# Altium schematic sheet dispay.SchDoc
size A4
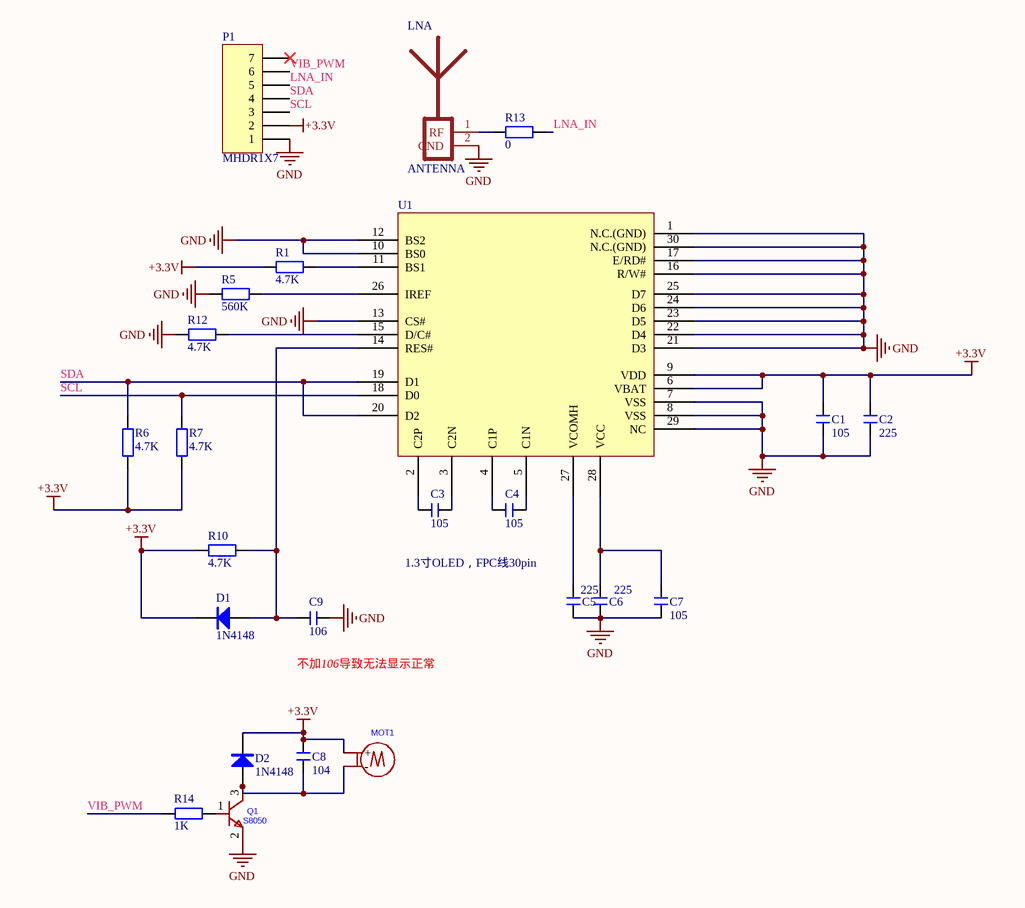
[diagram p0: dispay.SchDoc]

## Parts
C1  105  [C0402-min]
C2  225  [C0402-min]
C3  105  [C0402-min]
C4  105  [C0402-min]
C5  225  [C0402-min]
C6  225  [C0402-min]
C7  105  [C0402-min]
C8  104  [C0402-min]
C9  106  [C0402-min]
D1  1N4148  [SOD-323]
D2  1N4148  [SOD-323]
LNA  ANTENNA  [SWRA117D]
MOT1  LCM1027A2445F  [Vibration_Motor0820]  (value not drawn)
P1  MHDR1X7  [MHDR1X7]
Q1  S8050  [SOT-23-3]
R1  4.7K  [R0402]
R5  560K  [R0402]
R6  4.7K  [R0402]
R7  4.7K  [R0402]
R10  4.7K  [R0402]
R12  4.7K  [R0402]
R13  0  [R0402]
R14  1K  [R0402]
U1  1.3寸OLED，FPC线30pin  [0.96OLED]

## Nets
+3.3V: C1.2 C2.2 C8.2 D1.2(K) D2.2(K) MOT1.2(+) P1.2 R1.1 R6.1 R7.1 R10.1 U1.6(VBAT) U1.9(VDD)
GND: C1.1 C2.1 C5.1 C6.1 C7.1 C9.2 LNA.2(GND) P1.1 Q1.2(E) R5.1 R12.2 U1.1(N.C.(GND)) U1.7(VSS) U1.8(VSS) U1.10(BS0) U1.12(BS2) U1.13(CS#) U1.16(R/W#) U1.17(E/RD#) U1.21(D3) U1.22(D4) U1.23(D5) U1.24(D6) U1.25(D7) U1.29(NC) U1.30(N.C.(GND))
LNA_IN: P1.5 R13.2
SCL: P1.3 R7.2 U1.18(D0)
SDA: P1.4 R6.2 U1.19(D1) U1.20(D2)
VIB_PWM: P1.6 R14.1
NetC3_1: C3.1 U1.2(C2P)
NetC3_2: C3.2 U1.3(C2N)
NetC4_1: C4.1 U1.4(C1P)
NetC4_2: C4.2 U1.5(C1N)
NetC5_2: C5.2 U1.27(VCOMH)
NetC6_2: C6.2 C7.2 U1.28(VCC)
NetC8_1: C8.1 D2.1(A) MOT1.1(-) Q1.3(C)
NetC9_1: C9.1 D1.1(A) R10.2 U1.14(RES#)
NetLNA_1: LNA.1(RF) R13.1
NetQ1_1: Q1.1(B) R14.2
NetR1_2: R1.2 U1.11(BS1)
NetR5_2: R5.2 U1.26(IREF)
NetR12_1: R12.1 U1.15(D/C#)

Not connected (* = marked no-connect by the designer): P1 7*

## Notes on the sheet
- (near C9) 不加106导致无法显示正常

## Library data of the parts
C1-C9 = C: 无极性贴片电容; 版权归属: 源创客; 材质: X7R; BOM名称: 无极性贴片电容; 学习资源: www.ooocke.com
D1 D2 = 1N4148: 高速开关二极管; 版权归属: 源创客; BOM名称: 高速开关二极管; 学习资源: www.ooocke.com
MOT1 = Vibration_Motor: Manufacturer: LEADER(立得); Add into BOM: yes; Rated Voltage: 3V; Rated Current: 80mA; Rated Speed: 10000rpm; Sense Of Rotation: CW；CCW; Symbol: LCM1027A2445F; Device: LCM1027A2445F; LCSC Part Name: 扁平1027 振动马达; Supplier Part: C2759984; Manufacturer Part: LCM1027A2445F; Supplier Footprint: -; JLCPCB Part Class: Extended Part; Datasheet: https://atta.szlcsc.com/upload/public/pdf/source/20210326/C2759984_5008EC97BD438BDFB6866D31635439F4.pdf; Supplier: LCSC; Convert to PCB: yes; Type: 扁平振动马达; Operating Temperature: -20℃~+60℃
P1 = MHDR1X7: Header, 7-Pin; LatestRevisionDate: 17-Jul-2002; LatestRevisionNote: Re-released for DXP Platform.; Publisher: Altium Limited
Q1 = S8050: Manufacturer: 宏嘉诚; Symbol: S8050_C20069125; Add into BOM: yes; type: NPN; Current - Collector(Ic): 500mA; Collector - Emitter Voltage VCEO: 25V; Pd - Power Dissipation: 300mW; DC Current Gain: 120@50mA,1.0V; Transition frequency(fT): 100MHz; Current - Collector Cutoff: 100nA; Vce Saturation(VCE(sat)): 600mV; Device: S8050_C20069125; LCSC Part Name: hFE:200-350，丝印:J3Y S8050; Supplier Part: C20069125; Manufacturer Part: S8050; Supplier Footprint: SOT-23; JLCPCB Part Class: Extended Part; Datasheet: https://atta.szlcsc.com/upload/public/pdf/source/20250107/343E8B94B5C24D0D65D7D4B70E0B73F6.pdf; Supplier: LCSC; Convert to PCB: yes; Operating Temperature: -55℃~+150℃
R1 R5-R7 R10 R12-R14 = R: 贴片电阻; 版权归属: 源创客; BOM名称: 贴片电阻; 学习资源: www.ooocke.com